# Altium schematic sheet 09_Power_LDO.SchDoc
size A4
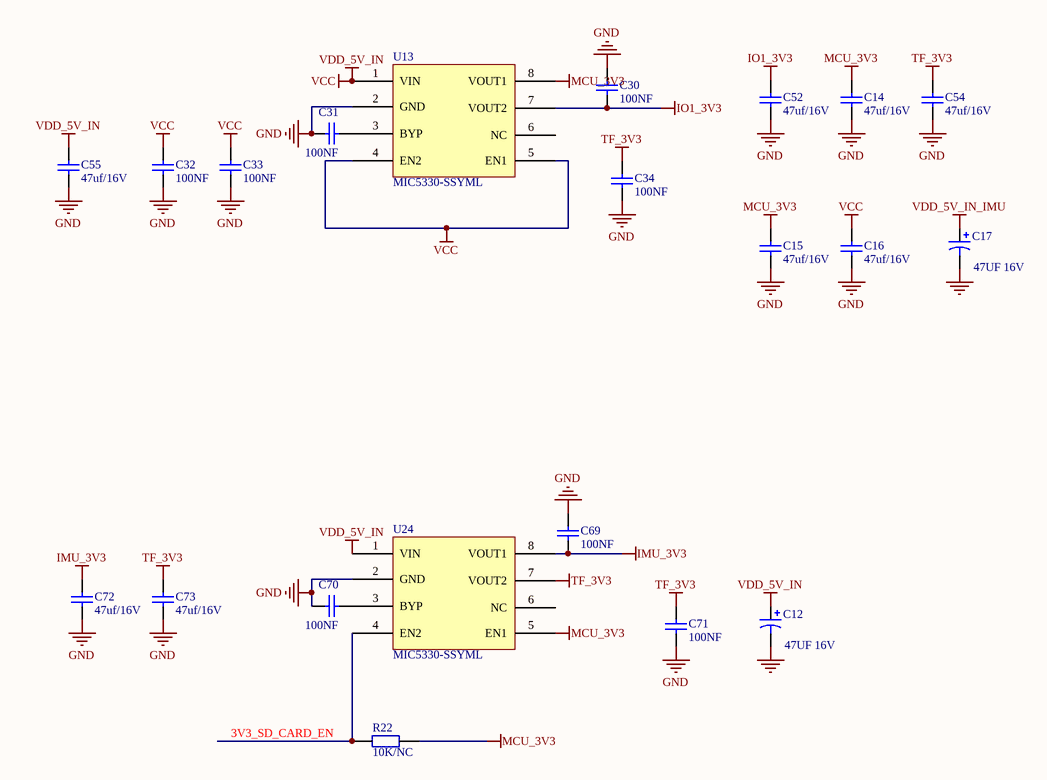
[diagram p0: 09_Power_LDO.SchDoc]

## Parts
C12  47UF 16V  [7343CAP]
C14  47uf/16V  [0805CAP]
C15  47uf/16V  [0805CAP]
C16  47uf/16V  [0805CAP]
C17  47UF 16V  [7343CAP]
C30  100NF  [0402CAP]
C31  100NF  [0402CAP]
C32  100NF  [0402CAP]
C33  100NF  [0402CAP]
C34  100NF  [0402CAP]
C52  47uf/16V  [0805CAP]
C54  47uf/16V  [0805CAP]
C55  47uf/16V  [0805CAP]
C69  100NF  [0402CAP]
C70  100NF  [0402CAP]
C71  100NF  [0402CAP]
C72  47uf/16V  [0805CAP]
C73  47uf/16V  [0805CAP]
R22  10K/NC  [0402R]
U13  MIC5330-SSYML  [MIC5530]
U24  MIC5330-SSYML  [MIC5530]

## Nets
GND: C12.C C14.2 C15.2 C16.2 C17.C C30.2 C31.2 C32.1 C33.1 C34.1 C52.2 C54.2 C55.2 C69.2 C70.2 C71.1 C72.2 C73.2 U13.2(GND) U24.2(GND)
IMU_3V3: C69.1 C72.1 U24.8(VOUT1)
IO1_3V3: C30.1 C52.1 U13.7(VOUT2)
MCU_3V3: C14.1 C15.1 R22.1 U13.8(VOUT1) U24.5(EN1)
TF_3V3: C34.2 C54.1 C71.2 C73.1 U24.7(VOUT2)
VCC: C12.A C16.1 C32.2 C33.2 C55.1 U13.1(VIN) U13.4(EN2) U13.5(EN1) U24.1(VIN)  [also labelled VDD_5V_IN]
VDD_5V_IN_IMU: C17.A
3V3_SD_CARD_EN: R22.2 U24.4(EN2)
NetC31_1: C31.1 U13.3(BYP)
NetC70_1: C70.1 U24.3(BYP)

Not connected (* = marked no-connect by the designer): U13 6(NC); U24 6(NC)

## Library data of the parts
C12 C17 = Cap Pol1: T520V476M016ATE; Value: 100pF; Published: 8-Jun-2000; LatestRevisionDate: 17-Jul-2002; LatestRevisionNote: Re-released for DXP Platform.; PackageReference: RB7.6-15; Publisher: Altium Limited; PackageDescription: Polarized Capacitor (Radial); 2 Leads
C14-C16 C52 C54 C55 C72 C73 = Cap: Capacitor
C30-C33 C69 C70 = Cap: Value: 100pF; Published: 8-Jun-2000; LatestRevisionDate: 17-Jul-2002; LatestRevisionNote: Re-released for DXP Platform.; PackageReference: RAD-0.3; Publisher: Altium Limited; PackageDescription: Radial Cap, Thru-Hole; 2 Leads; 0.3 in Pin Spacing
C34 C71 = Cap
R22 = 0402R10K: 0402R10K 1%
U13 U24 = MIC5530